# EAGLE design tian_light_servo_revd (EAGLE 6.1)
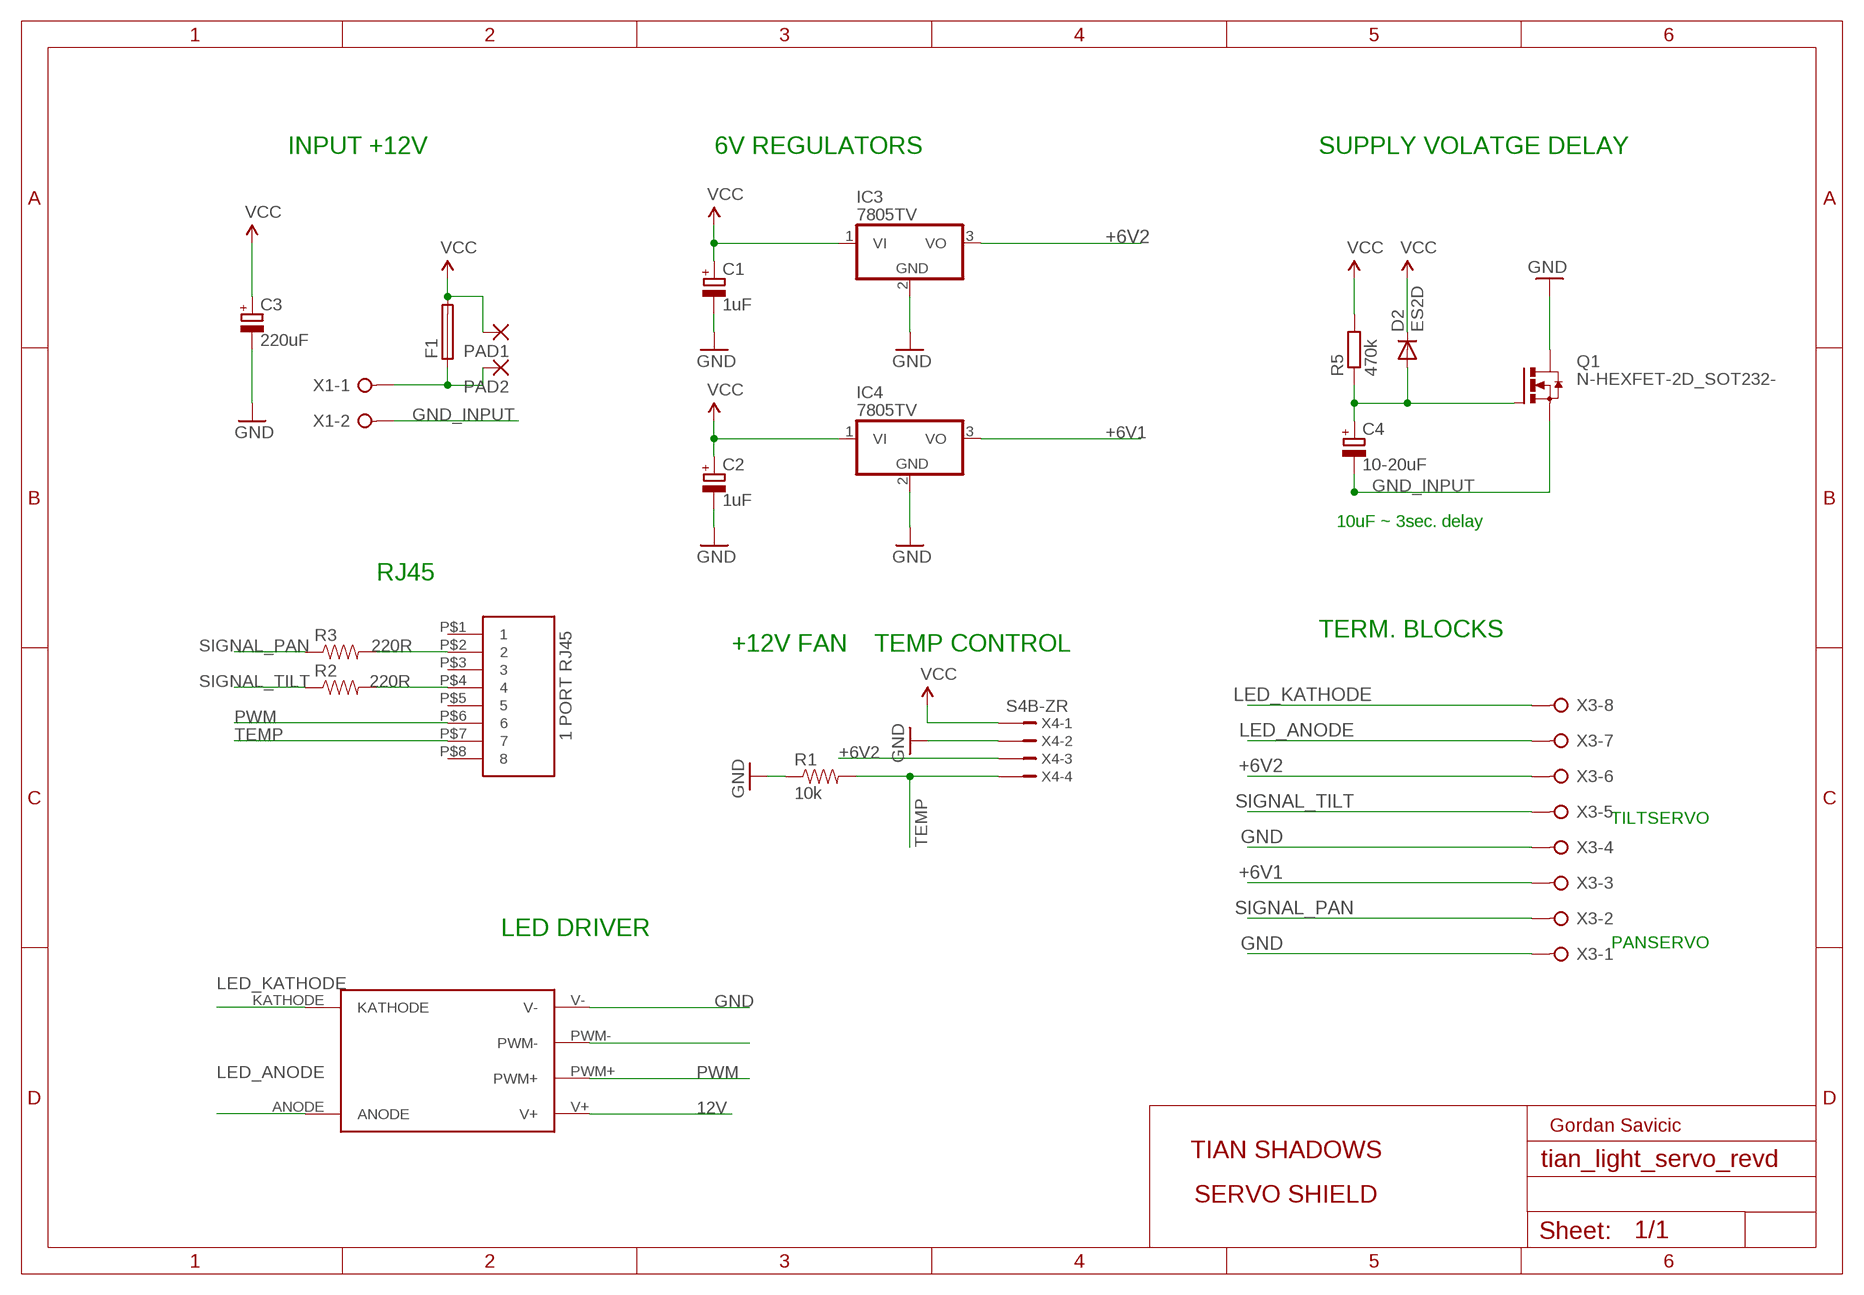
[diagram p0: schematic, sheet 1]

## Parts
C1  1uF  CPOL-EUSMCC  [SMC_C]
C2  1uF  CPOL-EUSMCC  [SMC_C]
C3  220uF  CPOL-EUF  [PANASONIC_F]
C4  10-20uF  CPOL-EUG  [PANASONIC_G]
D2  ES2D  [SMB]
F1  SH22,5  [SH22,5]
IC3  7805TV  [TO220V]
IC4  7805TV  [TO220V]
PAD1  2,15/1,0  [2,15/1,0]
PAD2  2,15/1,0  [2,15/1,0]
Q1  N-HEXFET-2D_SOT232-  [SOT223]
R1  10k  RESISTOR1206  [1206]
R2  220R  RESISTOR1206  [1206]
R3  220R  RESISTOR1206  [1206]
R5  470k  R-EU_R1218  [R1218]
U$1  BUCK_LED_DRIVER  [BUCK_LED_DRIVER]
U$5  1PORT_ETHERNET  [1PORT_ETHERNET]
X1  W237-02P  [W237-132]
X3  W237-08P  [W237-8P]
X4  S4B-ZR  [S4B-ZR]

## Nets
12V: C1.+ C2.+ C3.+ D2.C F1.2 IC3.1(VI) IC4.1(VI) PAD1.1(P) R5.2 U$1.V+ X4.1 ; supply symbol labelled VCC
+6V1: IC4.3(VO) X3.3
+6V2: IC3.3(VO) X3.6 X4.3
GND: C1.- C2.- C3.- IC3.2(GND) IC4.2(GND) Q1.2(D) Q1.4(D) R1.1 U$1.V- X3.1 X3.4 X4.2
GND_INPUT: C4.- Q1.3(S) X1.2
LED_ANODE: U$1.ANODE X3.7
LED_KATHODE: U$1.KATHODE X3.8
N$1: R2.2 U$5.P$4
N$2: R3.2 U$5.P$2
N$4: C4.+ D2.A Q1.1(G) R5.1
N$5: U$1.PWM-
N$6: F1.1 PAD2.1(P) X1.1
PWM: U$1.PWM+ U$5.P$6
SIGNAL_PAN: R3.1 X3.2
SIGNAL_TILT: R2.1 X3.5
TEMP: R1.2 U$5.P$7 X4.4
Unconnected: U$5.P$1 U$5.P$3 U$5.P$5 U$5.P$8

## Notes on the sheet
- INPUT +12V | 6V REGULATORS | SUPPLY VOLATGE DELAY
- 10uF ~ 3sec. delay
- RJ45
- TERM. BLOCKS
- +12V FAN | TEMP CONTROL
- TILTSERVO
- LED DRIVER | PANSERVO
- Gordan Savicic
- TIAN SHADOWS
- SERVO SHIELD

## Library data of the parts
C1 C2 = resistor:CPOL-EU: POLARIZED CAPACITOR, European symbol
C3 C4 = rcl:CPOL-EU: POLARIZED CAPACITOR, European symbol
D2 = diode:ES2D: DIODE super fast rectifier, 2 A
F1 = fuse:SH22,5: FUSE HOLDER grid 22,5 mm, OGN0031 8201, Schurter (Buerklin); MF: SCHURTER; MPN: 0031.8201; OC_FARNELL: 1162740; OC_NEWARK: 96F8317
IC3 IC4 = linear:78*: Positive VOLTAGE REGULATOR Source: http://cache.national.com/ds/LM/LM78L05.pdf http://www.fairchildsemi.com/ds/LM/LM7805.pdf
PAD1 PAD2 = wirepad:2,15/1,0: THROUGH-HOLE PAD
Q1 = transistor-power:N-HEXFET-2D_?-*: HEXFET® Power MOSFET 2 Drain connects http://www.irf.com/product-info/datasheets/data/irll014n.pdf
R1-R3 = SparkFun:RESISTOR: Resistor Basic schematic elements and footprints for 0603, 1206, and PTH resistors.
R5 = rcl:R-EU_: RESISTOR, European symbol
U$1 = tian:BUCK_LED_DRIVER
U$5 = strukt:1PORT_ETHERNET
X1 = con-wago-508:W237-02P: WAGO SREW CLAMP; OC_FARNELL: unknown; OC_NEWARK: unknown
X3 = con-wago-508:W237-08P: WAGO SREW CLAMP; OC_FARNELL: unknown; OC_NEWARK: unknown
X4 = con-jst:?4B-ZR: ZH CONNECTOR 1.5 mm, 4 pin 1 row Source: http://www.jst.com .. eZH.pdf; MF: FARNELL; MPN: S4B-ZR(LF)(SN); OC_FARNELL: 9491830; OC_NEWARK: 38K8076

## Board
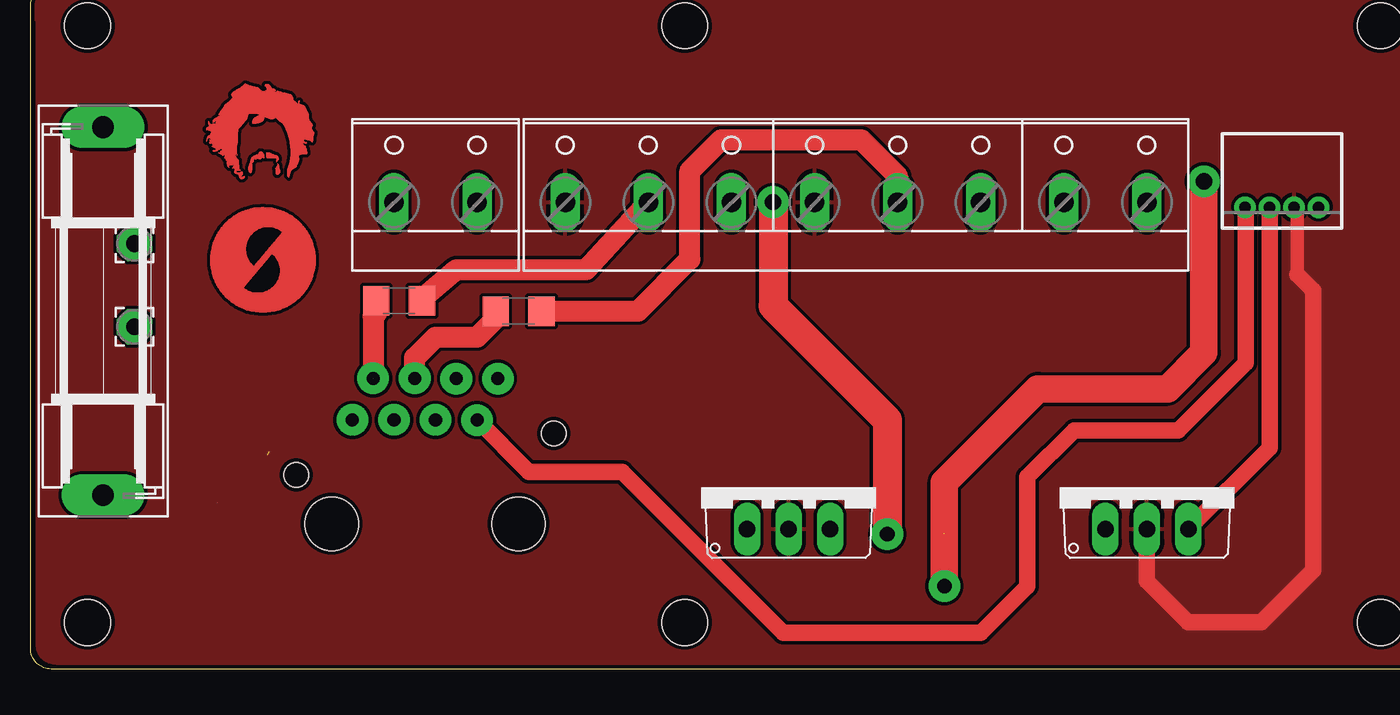
[diagram p1: board, top side]
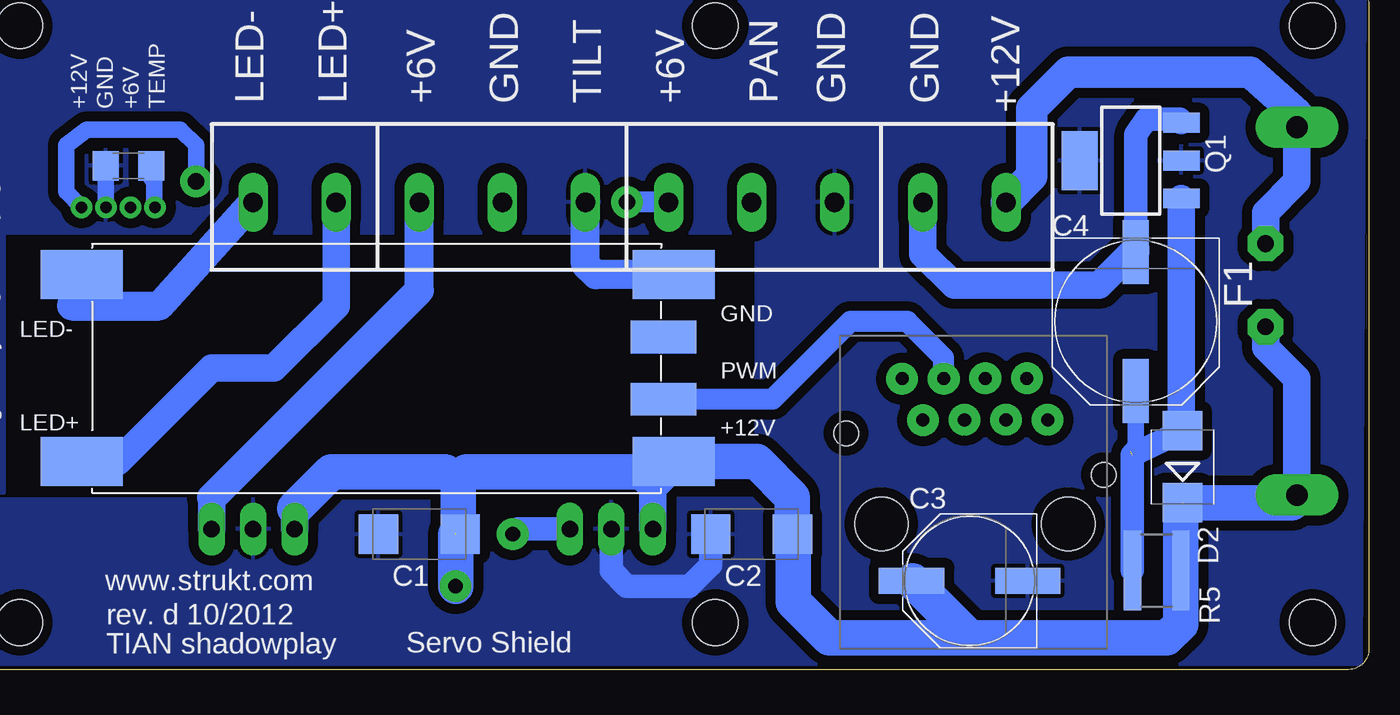
[diagram p2: board, bottom side, seen from below]

No outline drawn. Coordinates in mm, seen from the top.
Copper layers (1*16): Top 0.035mm / dielectric 1.5mm / Bottom 0.035mm
Design rules: minimum track width 8mil, minimum drill 20mil, track to track 8mil, track to pad 8mil, pad to pad 8mil, via to via 8mil, smd to smd 8mil, copper to edge 10mil, drill to drill 8mil, minimum pad ring 12mil, minimum via ring 10mil, stop-mask expansion 4mil, vias tented up to drill 25mil, thermal gap 10mil
Holes 2.8 mm at 40.01,39.37 82.55,2.86 82.55,39.37 3.49,39.37 40.01,2.86 3.49,2.86
Milling: 8 lines

### Footprints (pad centres in the part's own frame; a part is rotated, then mirrored left to right if it is on the bottom)
SMC_C = smd 2.4 x 2.4: + -2.5,0; - 2.5,0
PANASONIC_F = smd 4 x 1.6: + 3.55,0; - -3.55,0
PANASONIC_G = smd 3.9 x 1.6: + 4.25,0; - -4.25,0
SMB = smd 2.4 x 2.4: A 2.2,0; C -2.2,0
SH22,5 = drill 1.321 pad 2.54 long: 1 -11.252,0; 2 11.252,0
TO220V = drill 1.016 long: 1 -2.54,-2.54; 2 0,-2.54; 3 2.54,-2.54
2,15/1,0 = drill 1.016 pad 2.159 octagon: 1 0,0
SOT223 = smd 1.219 x 2.235: 1 -2.311,-3.099; 2 0,-3.099; 3 2.311,-3.099 | smd 3.6 x 2.2: 4 0,3.099
1206 = smd 1.6 x 1.8: 1 -1.4,0; 2 1.4,0
R1218 = smd 1.05 x 4.9: 1 -1.475,0; 2 1.475,0
BUCK_LED_DRIVER = smd 5 x 3: ANODE -0.635,1.905; KATHODE -0.635,13.335; V+ 35.56,1.905; V- 35.56,13.335 | smd 4 x 2: PWM+ 34.925,5.715; PWM- 34.925,9.525
1PORT_ETHERNET = drill 0.8 pad 1.93: P$1 -3.82,3.81; P$2 -6.36,2.54; P$3 -3.82,1.27; P$4 -6.36,0; P$5 -3.82,-1.27; P$6 -6.35,-2.54; P$7 -3.81,-3.81; P$8 -6.35,-5.08 | hole 3.25: 2.54,-6.35; 2.54,5.08 | hole 1.5: -3,-8.51; -0.46,7.24
W237-132 = drill 1.194 long: 1 -2.54,-0.635; 2 2.54,-0.635
W237-8P = drill 1.194 long: 1 -17.78,-0.635; 2 -12.7,-0.635; 3 -7.62,-0.635; 4 -2.54,-0.635; 5 2.54,-0.635; 6 7.62,-0.635; 7 12.7,-0.635; 8 17.78,-0.635
S4B-ZR = drill 0.7 pad 1.1: 1 -2.25,0; 2 -0.75,0; 3 0.75,0; 4 2.25,0

### Placement (x,y rotation side)
C1  58.1,8.26 180 bottom
C2  37.78,8.26 180 bottom
C3  24.45,5.4 180 bottom
C4  14.29,21.27 270 bottom
D2  11.43,12.38 90 bottom
F1  4.45,21.91 270 top
IC3  68.26,11.11 0 top
IC4  46.35,11.11 0 top
PAD1  6.35,20.95 0 top
PAD2  6.35,26.04 0 top
Q1  14.61,31.11 90 bottom
R1  75.88,30.8 0 bottom
R2  29.84,21.91 180 top
R3  22.54,22.54 180 top
R5  13.02,6.03 0 bottom
U$1  78.11,10.79 0 bottom
U$5  23.5,11.43 270 bottom
X1  24.77,29.21 0 top
X3  50.48,29.21 0 top
X4  76.52,28.26 180 top

### Tracks (layer width: path | path; a pad name or v marks a point on that pad's centre or on a via)
12V  (via drill 0.9 pad 1.93, 1 pad 1.93)  (2 unrouted)
  Top 1.676: v55.88,5.08 55.88,11.43 61.59,17.14 69.53,17.14 71.75,19.37 v71.75,29.84
  Bottom 1.016: 55.88,8.29 C1.+ | 35.24,8.21 C2.+ | X4.1 78.77,28.29 79.69,29.21 79.69,32.07 78.42,33.02 72.71,33.02 71.75,32.07 v71.75,29.84
  Bottom 1.422: C3.+ 27.94,5.4
  Bottom 1.676: 43.81,11.43 IC4.1 | IC3.1 65.72,9.84 | PAD1.1 6.35,19.68 4.45,17.78 F1.2
  Bottom 1.778: 56.52,12.06 55.72,11.59
  Bottom 1.93: 11.41,10.16 D2.C
  Bottom 2.184: 65.72,9.84 63.5,12.06 56.52,12.06 | C2.+ 35.28,10.52 37.47,12.7 U$1.V+ 43.81,11.43 44.45,12.06 55.24,12.06 55.72,11.59 55.72,8.41 55.88,8.26 | v55.88,5.08 55.88,7.98 C1.+ | 24.45,1.91 12.38,1.91 11.54,2.75 R5.2 11.54,10.05 11.43,10.16 | 24.45,1.91 27.94,5.4 | 24.45,1.91 33.02,1.91 35.24,4.13 35.24,8.21 | F1.2 4.76,10.16 11.41,10.16
+6V1  (via drill 0.9 pad 1.93, 1 pad 1.93)
  Top 1.778: v45.4,28.57 45.4,22.23 52.39,15.24 v52.39,8.26
  Bottom 1.27: X3.3 v45.4,28.57
  Bottom 1.422: IC4.3 52.07,8.57 v52.39,8.26
+6V2
  Top 1.016: X4.3 75.77,13.54 IC3.3
  Bottom 1.676: 70.8,10.48 IC3.3
  Bottom 1.778: 70.8,10.48 58.1,23.18 X3.6
GND
  Top 0.813: 77.47,24.13 77.47,28.05 X4.2
  Top 1.016: 77.47,24.13 78.42,23.18 78.42,6.03 75.25,2.86 70.8,2.86 68.26,5.4 IC3.2
  Bottom 1.016: X4.2 77.27,30.05 77.15,30.8 77.47,30.8
  Bottom 1.422: C2.- 40.28,6.39 41.59,5.08 45.4,5.08 46.35,6.03 IC4.2
  Bottom 1.778: U$1.V- 47.31,24.13 47.94,24.77 X3.4
  pour Bottom (isolate 0.61): 0.53,0.29 85.31,0.28 85.11,10.42 37.47,10.48 37.47,26.67 83.5,26.67 83.5,10.79 85.25,10.79 85.25,41.34 0.34,41.3
  pour Top: 0.28,39.66 0.28,40.61 arc-90 1.01,41.34 84.52,41.34 arc-90 85.43,40.43 85.43,1.01 arc-90 84.7,0.28 1.56,0.28 arc-90 0.35,1.49 0.35,39.63 arc90 0.31,39.67
GND_INPUT
  Bottom 1.422: C4.- 14.29,32.7 13.65,33.66 11.6,33.66 Q1.3
  Bottom 1.676: C4.- 14.29,25.72 16.51,23.5 25.4,23.5 27.3,25.4 X1.2
LED_ANODE
  Bottom 1.016: X3.7 63.18,27.3
  Bottom 1.676: U$1.ANODE 76.52,12.7 70.8,18.41 66.99,18.41 63.18,22.23 X3.7
LED_KATHODE
  Bottom 1.778: U$1.KATHODE 79.38,22.23 73.98,22.23 X3.8
N$1
  Top 1.016: R2.2 28.45,21.72 28.57,21.59
  Top 1.27: U$5.P$4 23.5,19.05 24.77,20.32 27.3,20.32 28.57,21.59
N$2  (1 unrouted)
  Top 1.27: R3.2 21.14,21.78 20.95,21.59 U$5.P$2
N$4  (1 unrouted)
  Bottom 1.016: C4.+ 14.29,13.65 14.61,13.34
  Bottom 1.422: D2.A 14.49,13.11 R5.1
  Bottom 1.676: Q1.1 11.51,15.29 D2.A
N$6
  Bottom 1.676: PAD2.1 6.35,27.94 4.45,29.84 F1.1
  Bottom 1.93: F1.1 4.45,33.97 7.3,36.51 18.41,36.51 20.64,34.29 20.64,30.16 X1.1
PWM
  Bottom 1.27: U$5.P$6 26.04,19.05 28.26,21.27 31.75,21.27 36.51,16.51 U$1.PWM+
SIGNAL_PAN
  Top 1.27: R3.1 23.94,22.67 26.04,24.45 33.97,24.45 X3.2
SIGNAL_TILT
  Top 1.27: R2.1 37.15,21.91 40.32,25.08 40.32,30.48 42.23,32.38 50.8,32.38 53.02,30.16 X3.5
TEMP
  Top 1.016: X4.4 74.3,28.23 74.3,18.73 70.17,14.61 63.82,14.61 60.96,11.75 60.96,5.08 58.1,2.22 46.04,2.22 36.2,12.06 30.48,12.06 U$5.P$7
  Bottom 1.016: R1.2 74.48,30.03 74.3,29.84 74.3,28.29 X4.4
(copper drawn outside any net)
  shapes: Top area x2036

### Text on the board
bPlace: +12V | GND | GND | PAN | +6V | TILT | GND | +6V | LED+ | LED- | TEMP | +6V | GND | +12V | gordo@yugo.at | GND | LED- | designed by | PWM | LED+ | +12V | www.strukt.com | rev. d 10/2012 | Servo Shield | TIAN shadowplay